# EasyEDA schematic Электроника ПЭС EsayEDA.json
TITLE: Sheet_1; REV: 1.0; Date: 2021-10-21; Sheet: 1/1; Drawn By: Dan Sazonov; Company: Your Company
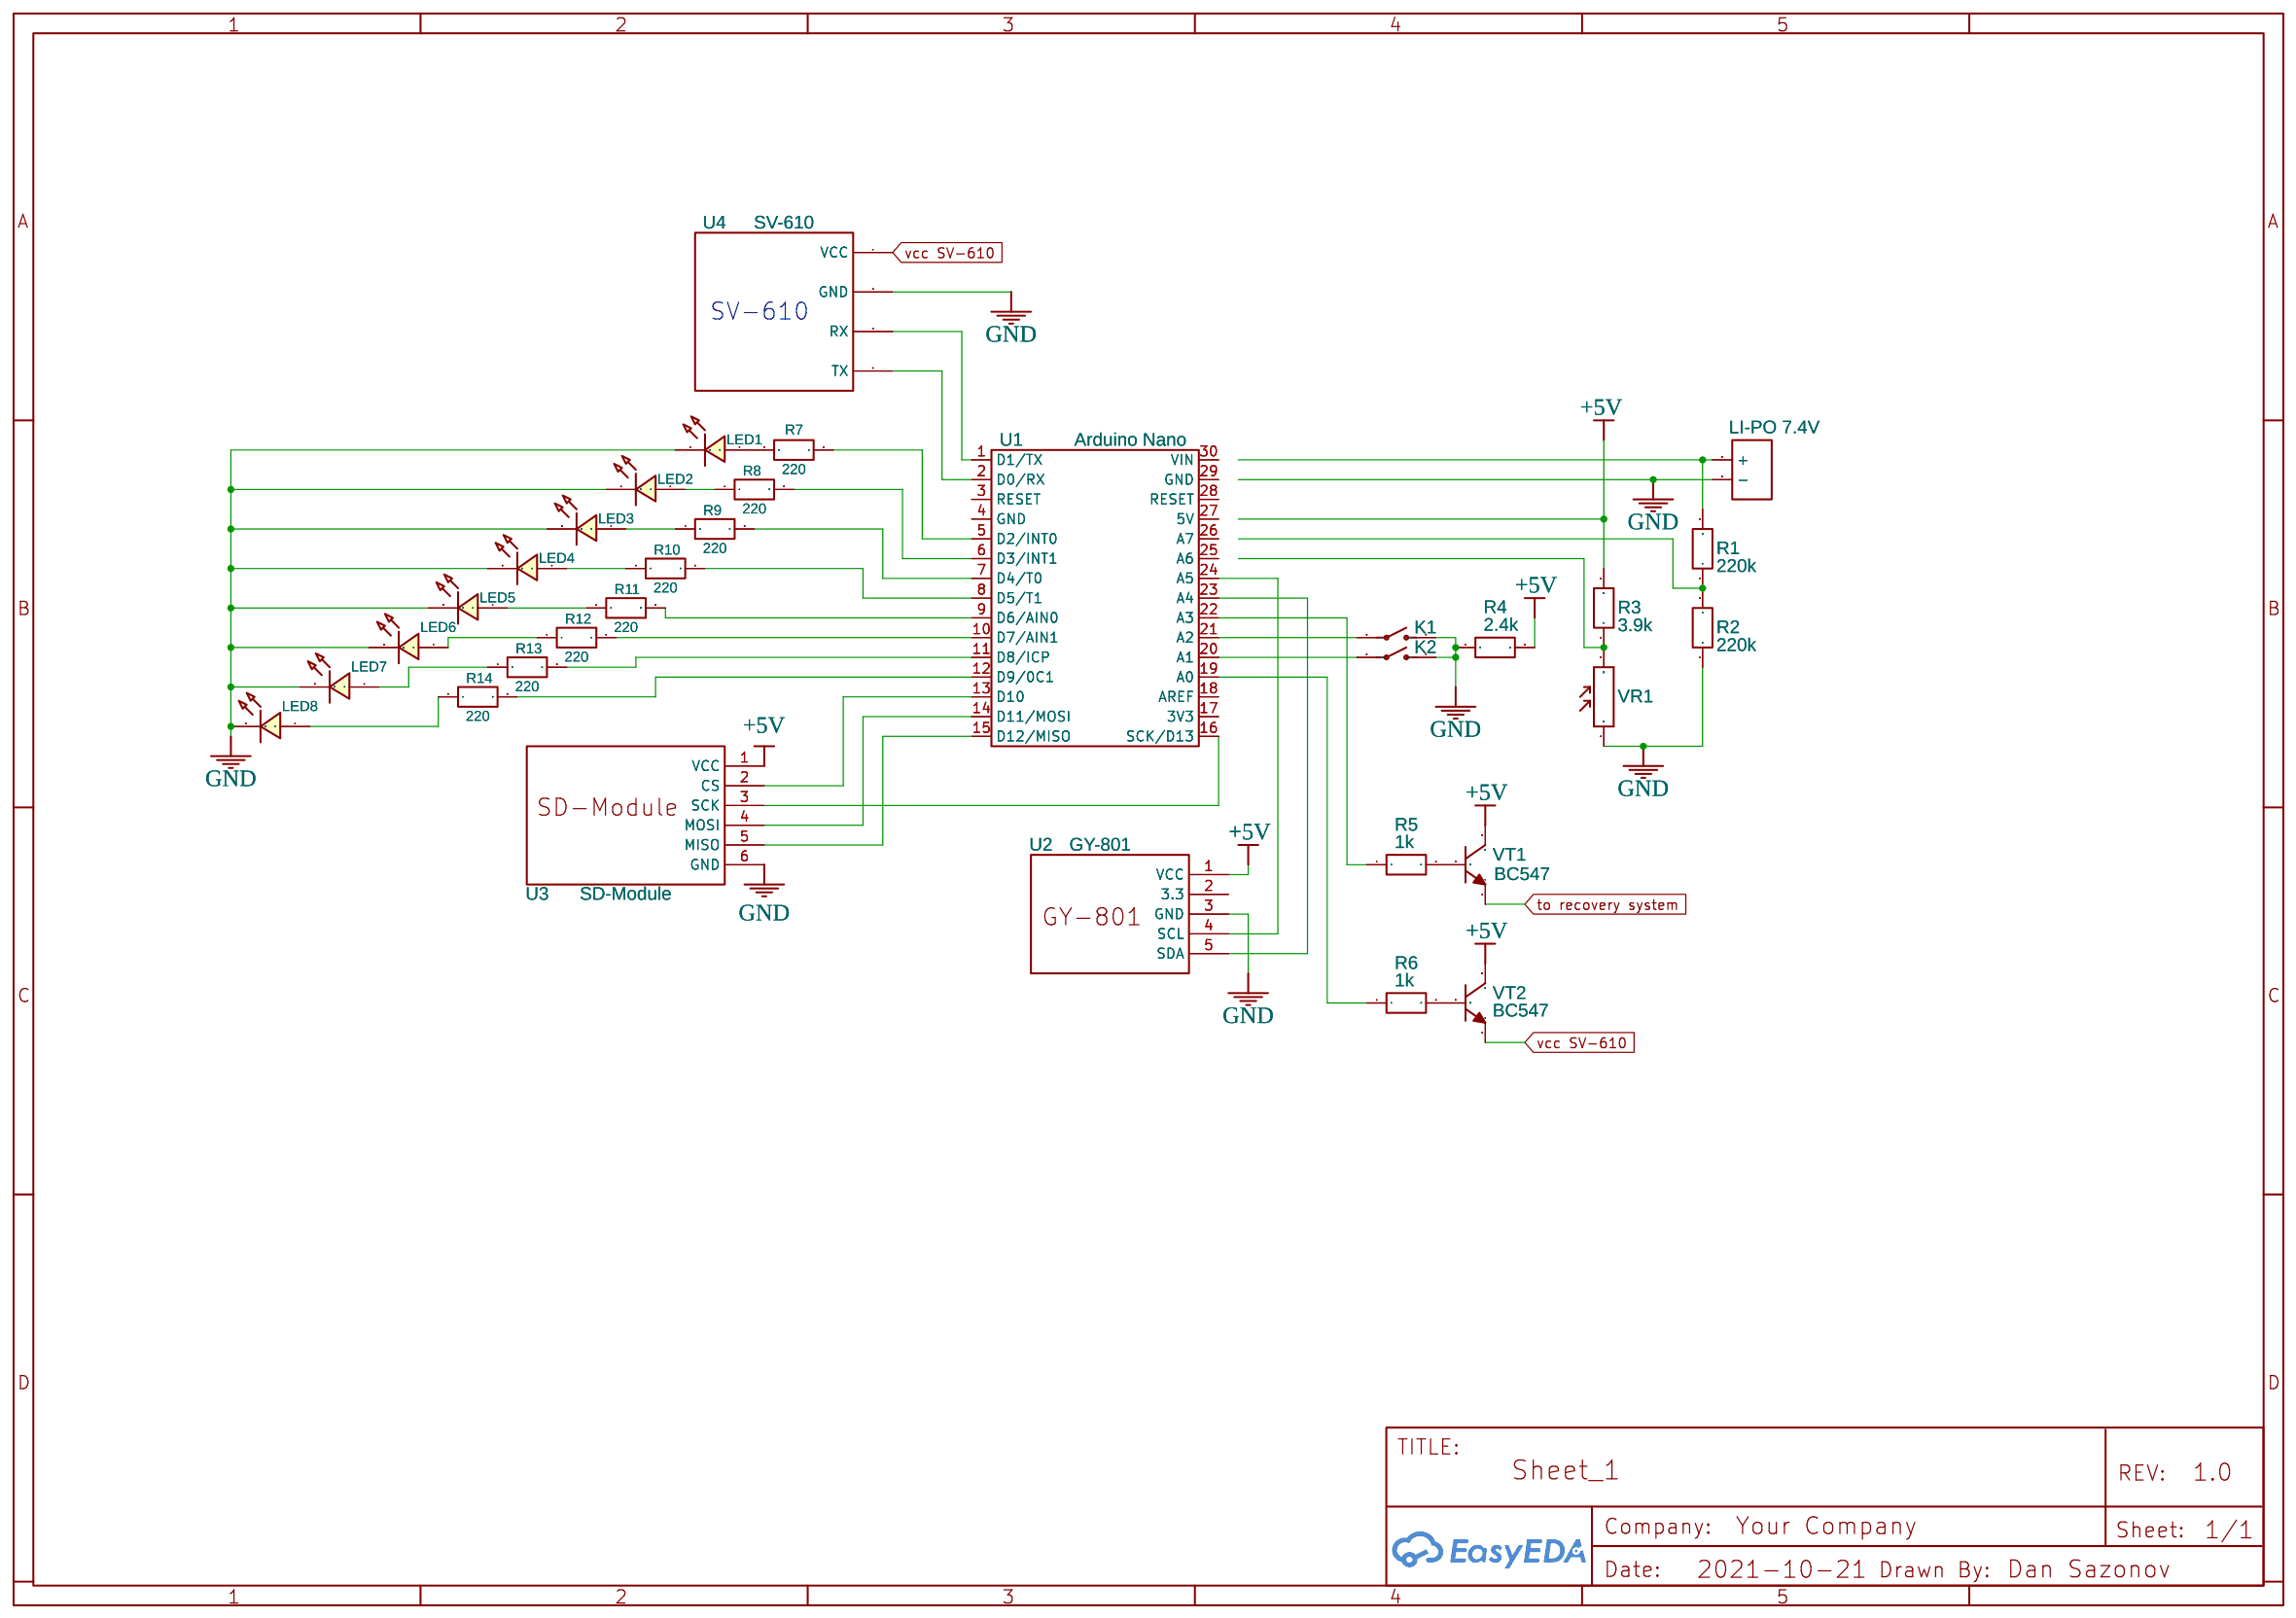
[diagram p0: schematic sheet]

## Parts
K1  SWITCH-SPST-2TV  [SWITCH-SPST-VERTICAL]
K2  SWITCH-SPST-2TV  [SWITCH-SPST-VERTICAL]
LED1  LED-0603_R  [LED0603_RED]
LED2  LED-0603_R  [LED0603_RED]
LED3  LED-0603_R  [LED0603_RED]
LED4  LED-0603_R  [LED0603_RED]
LED5  LED-0603_R  [LED0603_RED]
LED6  LED-0603_R  [LED0603_RED]
LED7  LED-0603_R  [LED0603_RED]
LED8  LED-0603_R  [LED0603_RED]
P1  LI-PO 7.4V  [CONN-TH_2P-P5.00]
R1  220k  [R0603]
R2  220k  [R0603]
R3  3.9k  [R0603]
R4  2.4k  [R0603]
R5  1k  [R0603]
R6  1k  [R0603]
R7  220  [R0603]
R8  220  [R0603]
R9  220  [R0603]
R10  220  [R0603]
R11  220  [R0603]
R12  220  [R0603]
R13  220  [R0603]
R14  220  [R0603]
U1  Arduino Nano  [DIP-30_L43.18-W15.24-ARDUINONANO]
U2  GY-801  [GY-801-SIMPLE]
U3  SD-Module  [SD-CARD-MODULE]
U4  SV-610
VR1  Photoresistor-5528  [SNR2-3.0]
VT1  BC547  [SOT-23-3_L2.9-W1.3-P1.90-LS2.4-TR]
VT2  BC547  [SOT-23-3_L2.9-W1.3-P1.90-LS2.4-TR]

## Library data of the parts
K1 K2 = SWITCH-SPST-2TV: Contributor: SparkFun
LED1-LED8 = LED-0603_R: Manufacturer: EVERLIGHT(台湾亿光); Manufacturer Part: 19-217/R6C-AL1M2VY/3T; Supplier Part: C72044; Supplier: LCSC; Contributor: LCEDA_01
P1 = CONN-TH_2P-P5.00: Supplier: LCSC; Contributor: LCEDA_Lib
R1-R14 = R_0603_EU: Contributor: LCEDA_Lib
U1 = Arduino_Nano_Header
U2 = GY-801: Manufacturer Part: GY-801 5 pin; Contributor: ol.al.dmi
U3 = SD-Card-Module: Supplier: Aliexpress; Contributor: Eugen2004
U4 = SV-610: Contributor: AlinaValyavkina
VR1 = Photoresistor-5528: DIP RES Photoresistor 10K;2P-3.0
VT1 VT2 = 2N3904(SOT-23): Supplier: LCSC; Manufacturer: KEC; Manufacturer Part: 2n3904S-RTK/PS; Supplier Part: C18536; Paste Type: SOT-23; Contributor: LCEDA_Lib

## Nets
+5V: R3.2 R4.2 U2.1(VCC) U3.1(VCC) VT1.3(C) VT2.3(C)
GND: K1.1(O) K2.1(O) LED1.2 LED2.2 LED3.2 LED4.2 LED5.2 LED6.2 LED7.2 LED8.2 P1.2(-) R2.1 R4.1 U2.3(GND) U3.6(GND) U4.3(GND) VR1.1(P$1)
vcc SV-610: U4.4(VCC) VT2.1(E)
to recovery system: VT1.1(E)
Net-(K1-2): K1.2(P) U1.21(A2)
Net-(K2-2): K2.2(P) U1.20(A1)
Net-(LED1-1): LED1.1 R7.1
Net-(LED2-1): LED2.1 R8.1
Net-(LED3-1): LED3.1 R9.1
Net-(LED4-1): LED4.1 R10.1
Net-(LED5-1): LED5.1 R11.1
Net-(LED6-1): LED6.1 R12.1
Net-(LED7-1): LED7.1 R13.1
Net-(LED8-1): LED8.1 R14.1
Net-(P1-1): P1.1(+) R1.2
Net-(R1-1): R1.1 R2.2
Net-(R3-1): R3.1 VR1.2(P$2)
Net-(R5-1): R5.1 U1.22(A3)
Net-(R5-2): R5.2 VT1.2(B)
Net-(R6-1): R6.1 U1.19(A0)
Net-(R6-2): R6.2 VT2.2(B)
Net-(R7-2): R7.2 U1.5(D2/INT0)
Net-(R8-2): R8.2 U1.6(D3/INT1)
Net-(R9-2): R9.2 U1.7(D4/T0)
Net-(R10-2): R10.2 U1.8(D5/T1)
Net-(R11-2): R11.2 U1.9(D6/AIN0)
Net-(R12-2): R12.2 U1.10(D7/AIN1)
Net-(R13-2): R13.2 U1.11(D8/ICP)
Net-(R14-2): R14.2 U1.12(D9/0C1)
Net-(U1-1): U1.1(D1/TX) U4.2(RX)
Net-(U1-2): U1.2(D0/RX) U4.1(TX)
Net-(U1-13): U1.13(D10) U3.2(CS)
Net-(U1-14): U1.14(D11/MOSI) U3.4(MOSI)
Net-(U1-15): U1.15(D12/MISO) U3.5(MISO)
Net-(U1-16): U1.16(SCK/D13) U3.3(SCK)
Net-(U1-23): U1.23(A4) U2.5(SDA)
Net-(U1-24): U1.24(A5) U2.4(SCL)

Not connected (* = marked no-connect by the designer): U1 3(RESET) 4(GND) 17(3V3) 18(AREF) 25(A6) 26(A7) 27(5V) 28(RESET) 29(GND) 30(VIN); U2 2(3.3)

## Notes on the sheet
- SV-610
